# Altium schematic sheet In-Channels.SchDoc
size A4; DocumentNumber: 2; SheetNumber: 2; SheetTotal: 6
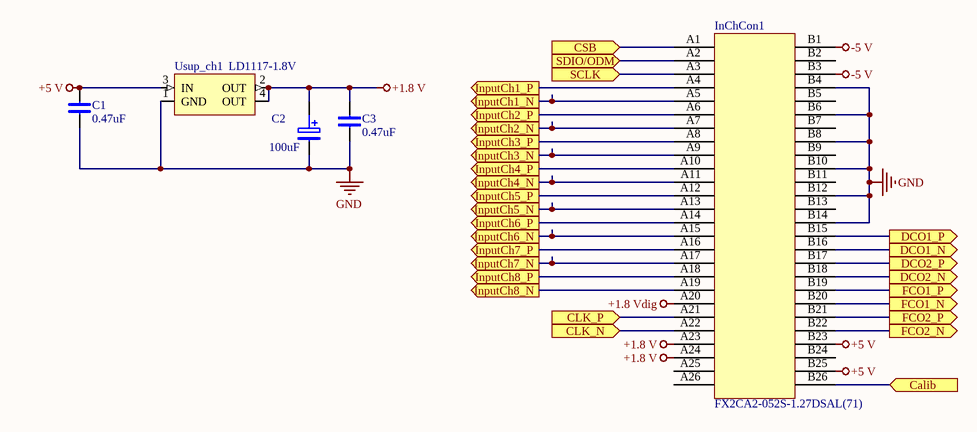
[diagram p0: In-Channels.SchDoc]

## Parts
C1  0.47uF  [chip0603]
C2  100uF  [CEL-SMD300]
C3  0.47uF  [chip0603]
InChCon1  FX2CA2-052S-1.27DSAL(71)  [FX2CA2-052S-1.27DSAL(71)]
Usup_ch1  LD1117-1.8V  [TO-252]

## Ports
Calib (in), CLK_N (in), CLK_P (in), CSB (in), DCO1_N (out), DCO1_P (out), DCO2_N (out), DCO2_P (out), FCO1_N (out), FCO1_P (out), FCO2_N (out), FCO2_P (out), InputCh1_N (out), InputCh1_P (out), InputCh2_N (out), InputCh2_P (out), InputCh3_N (out), InputCh3_P (out), InputCh4_N (out), InputCh4_P (out), InputCh5_N (out), InputCh5_P (out), InputCh6_N (out), InputCh6_P (out), InputCh7_N (out), InputCh7_P (out), InputCh8_N (out), InputCh8_P (out), SCLK (in), SDIO/ODM (in)

## Nets
+1.8 V: C2.+ C3.1 InChCon1.A23 InChCon1.A24 Usup_ch1.2(OUT) Usup_ch1.4(OUT)
+1.8 Vdig: InChCon1.A20
+5 V: C1.1 InChCon1.B23 InChCon1.B25 Usup_ch1.3(IN)
-5 V: InChCon1.B1 InChCon1.B3
GND: C1.2 C2.- C3.2 InChCon1.B4 InChCon1.B6 InChCon1.B8 InChCon1.B10 InChCon1.B12 InChCon1.B14 Usup_ch1.1(GND)
Calib: InChCon1.B26 ; port Calib
CLK_N: InChCon1.A22 ; port CLK_N
CLK_P: InChCon1.A21 ; port CLK_P
CSB: InChCon1.A1 ; port CSB
DCO1_N: InChCon1.B16 ; port DCO1_N
DCO1_P: InChCon1.B15 ; port DCO1_P
DCO2_N: InChCon1.B18 ; port DCO2_N
DCO2_P: InChCon1.B17 ; port DCO2_P
FCO1_N: InChCon1.B20 ; port FCO1_N
FCO1_P: InChCon1.B19 ; port FCO1_P
FCO2_N: InChCon1.B22 ; port FCO2_N
FCO2_P: InChCon1.B21 ; port FCO2_P
InputCh1_N: InChCon1.A5 ; port InputCh1_N
InputCh1_P: InChCon1.A4 ; port InputCh1_P
InputCh2_N: InChCon1.A7 ; port InputCh2_N
InputCh2_P: InChCon1.A6 ; port InputCh2_P
InputCh3_N: InChCon1.A9 ; port InputCh3_N
InputCh3_P: InChCon1.A8 ; port InputCh3_P
InputCh4_N: InChCon1.A11 ; port InputCh4_N
InputCh4_P: InChCon1.A10 ; port InputCh4_P
InputCh5_N: InChCon1.A13 ; port InputCh5_N
InputCh5_P: InChCon1.A12 ; port InputCh5_P
InputCh6_N: InChCon1.A15 ; port InputCh6_N
InputCh6_P: InChCon1.A14 ; port InputCh6_P
InputCh7_N: InChCon1.A17 ; port InputCh7_N
InputCh7_P: InChCon1.A16 ; port InputCh7_P
InputCh8_N: InChCon1.A19 ; port InputCh8_N
InputCh8_P: InChCon1.A18 ; port InputCh8_P
SCLK: InChCon1.A3 ; port SCLK
SDIO/ODM: InChCon1.A2 ; port SDIO/ODM

Not connected (* = marked no-connect by the designer): InChCon1 A25 A26 B2(2) B5(5) B7(7) B9(9) B11(11) B13(13) B24

## Library data of the parts
C1 C3 = C: Text Field1: 20; Text Field2: 10
C2 = C POL: Text Field1: 20; Text Field2: 20
Usup_ch1 = NCP1117-3.3V